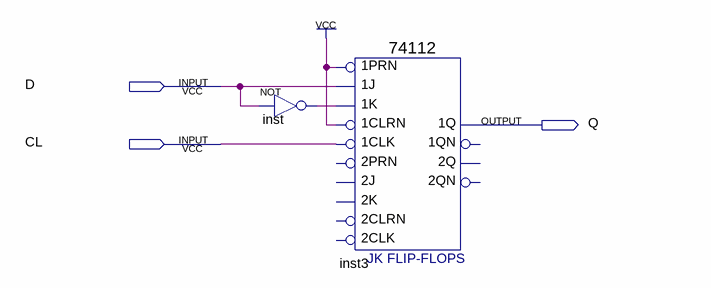
[diagram p0: schematic sheet]
// Quartus schematic problem3.bdf as structural Verilog: 2 symbols, 3 pins
module problem3 (
  input  D,
  input  CL,
  output Q
);

  wire inst_out;

  not inst (inst_out, D);
  \74112  inst3 (
    .\1K (inst_out), .\1J (D), .\1PRN (1'b1), .\1CLK (CL), .\1CLRN (1'b1), .\1Q (Q));  // open: 2K, 2J, 2PRN, 2CLK, 2CLRN, 1QN, 2Q, 2QN
endmodule
